# Altium schematic sheet Glog 5G_V1.SchDoc: RCW-360Pro-4G
size A2; DocumentNumber: JC-2.757.366DL; SheetNumber: 1; SheetTotal: 2
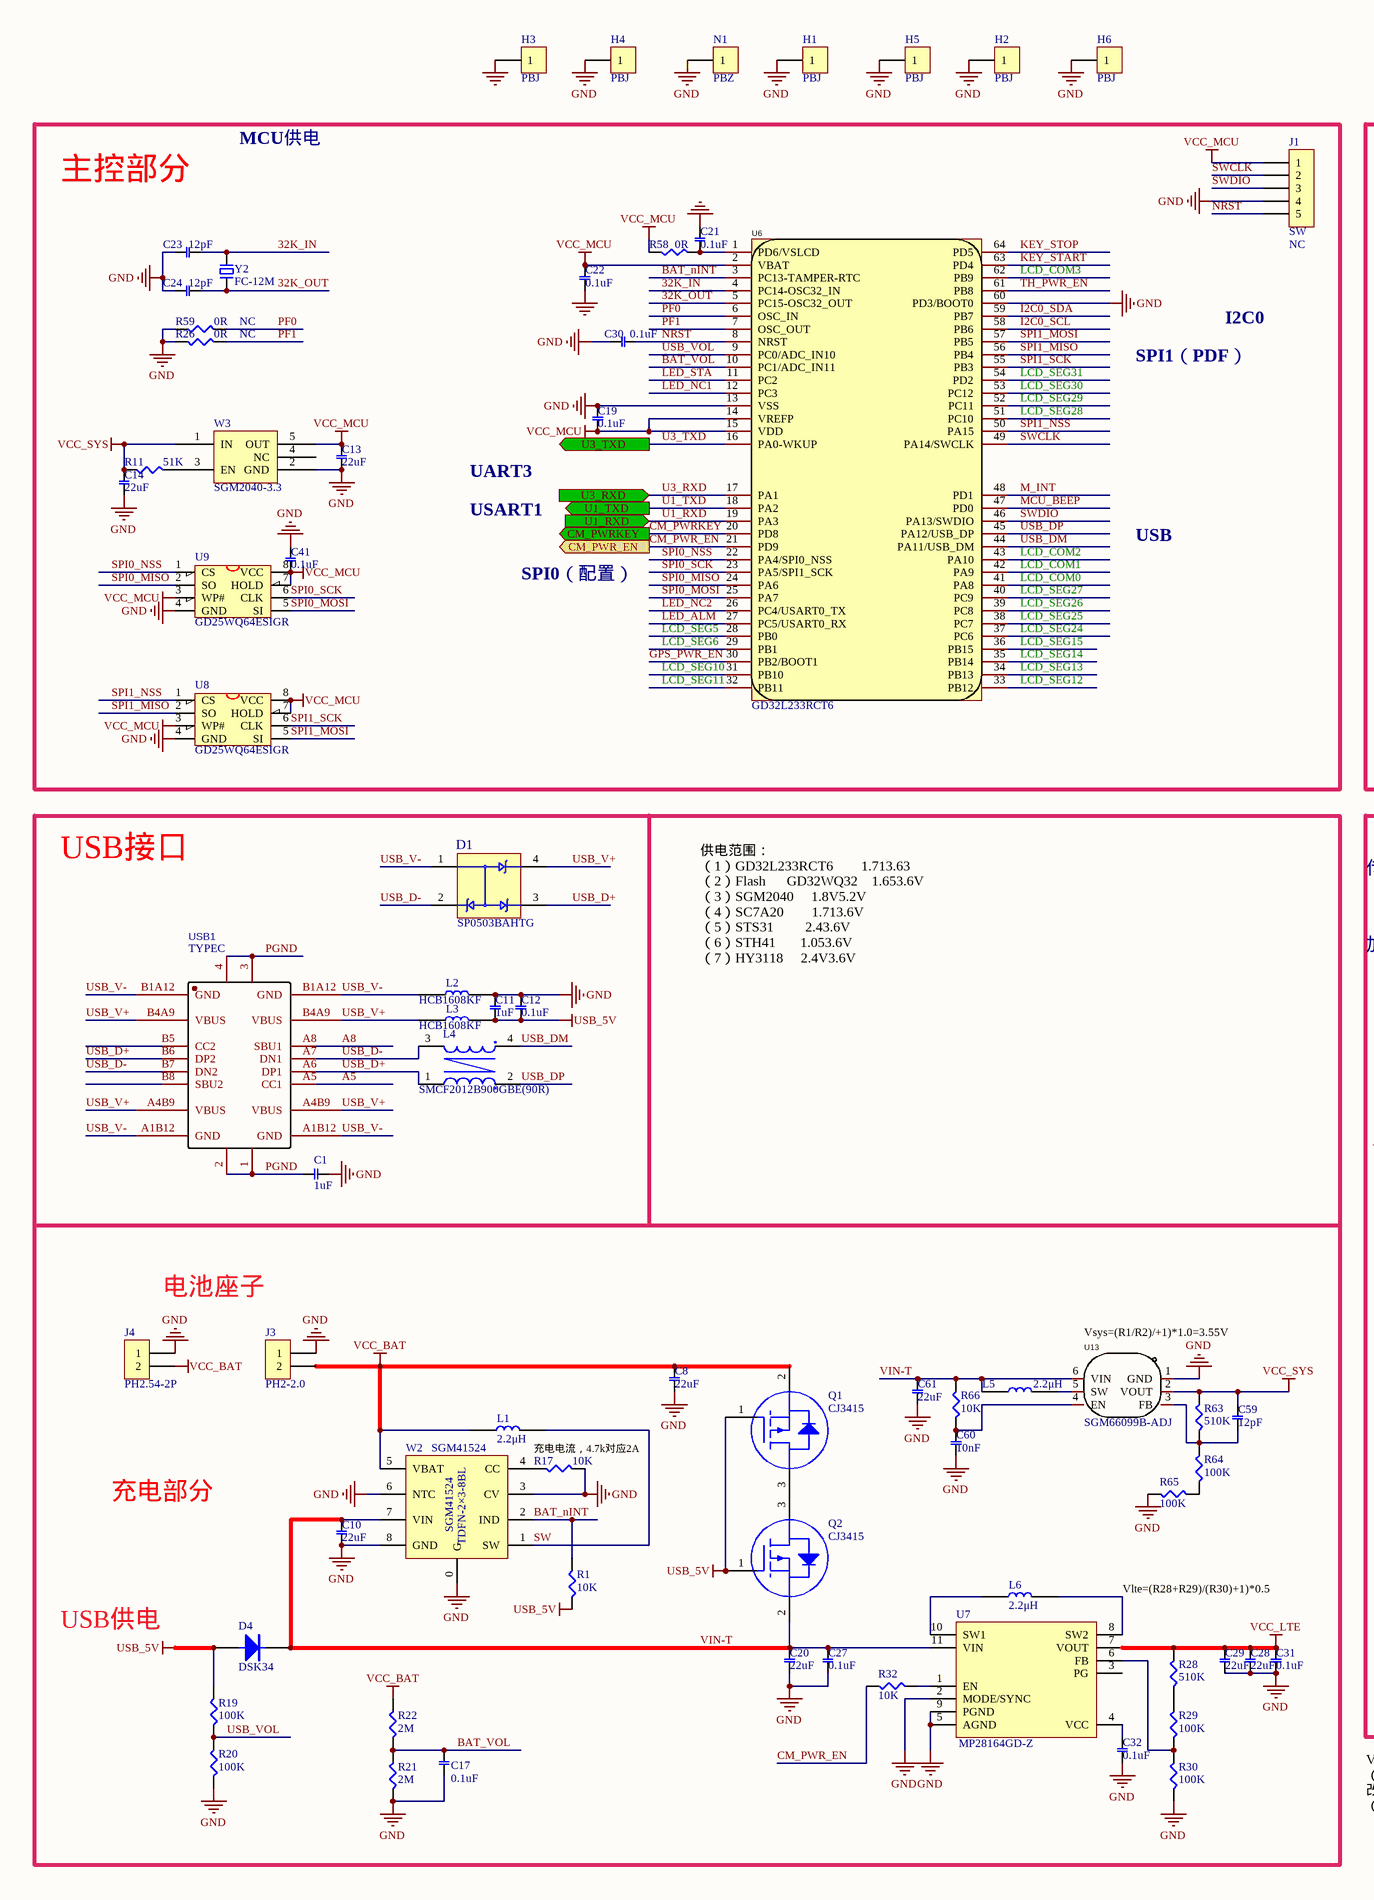
[diagram p0: Glog 5G_V1.SchDoc, left]
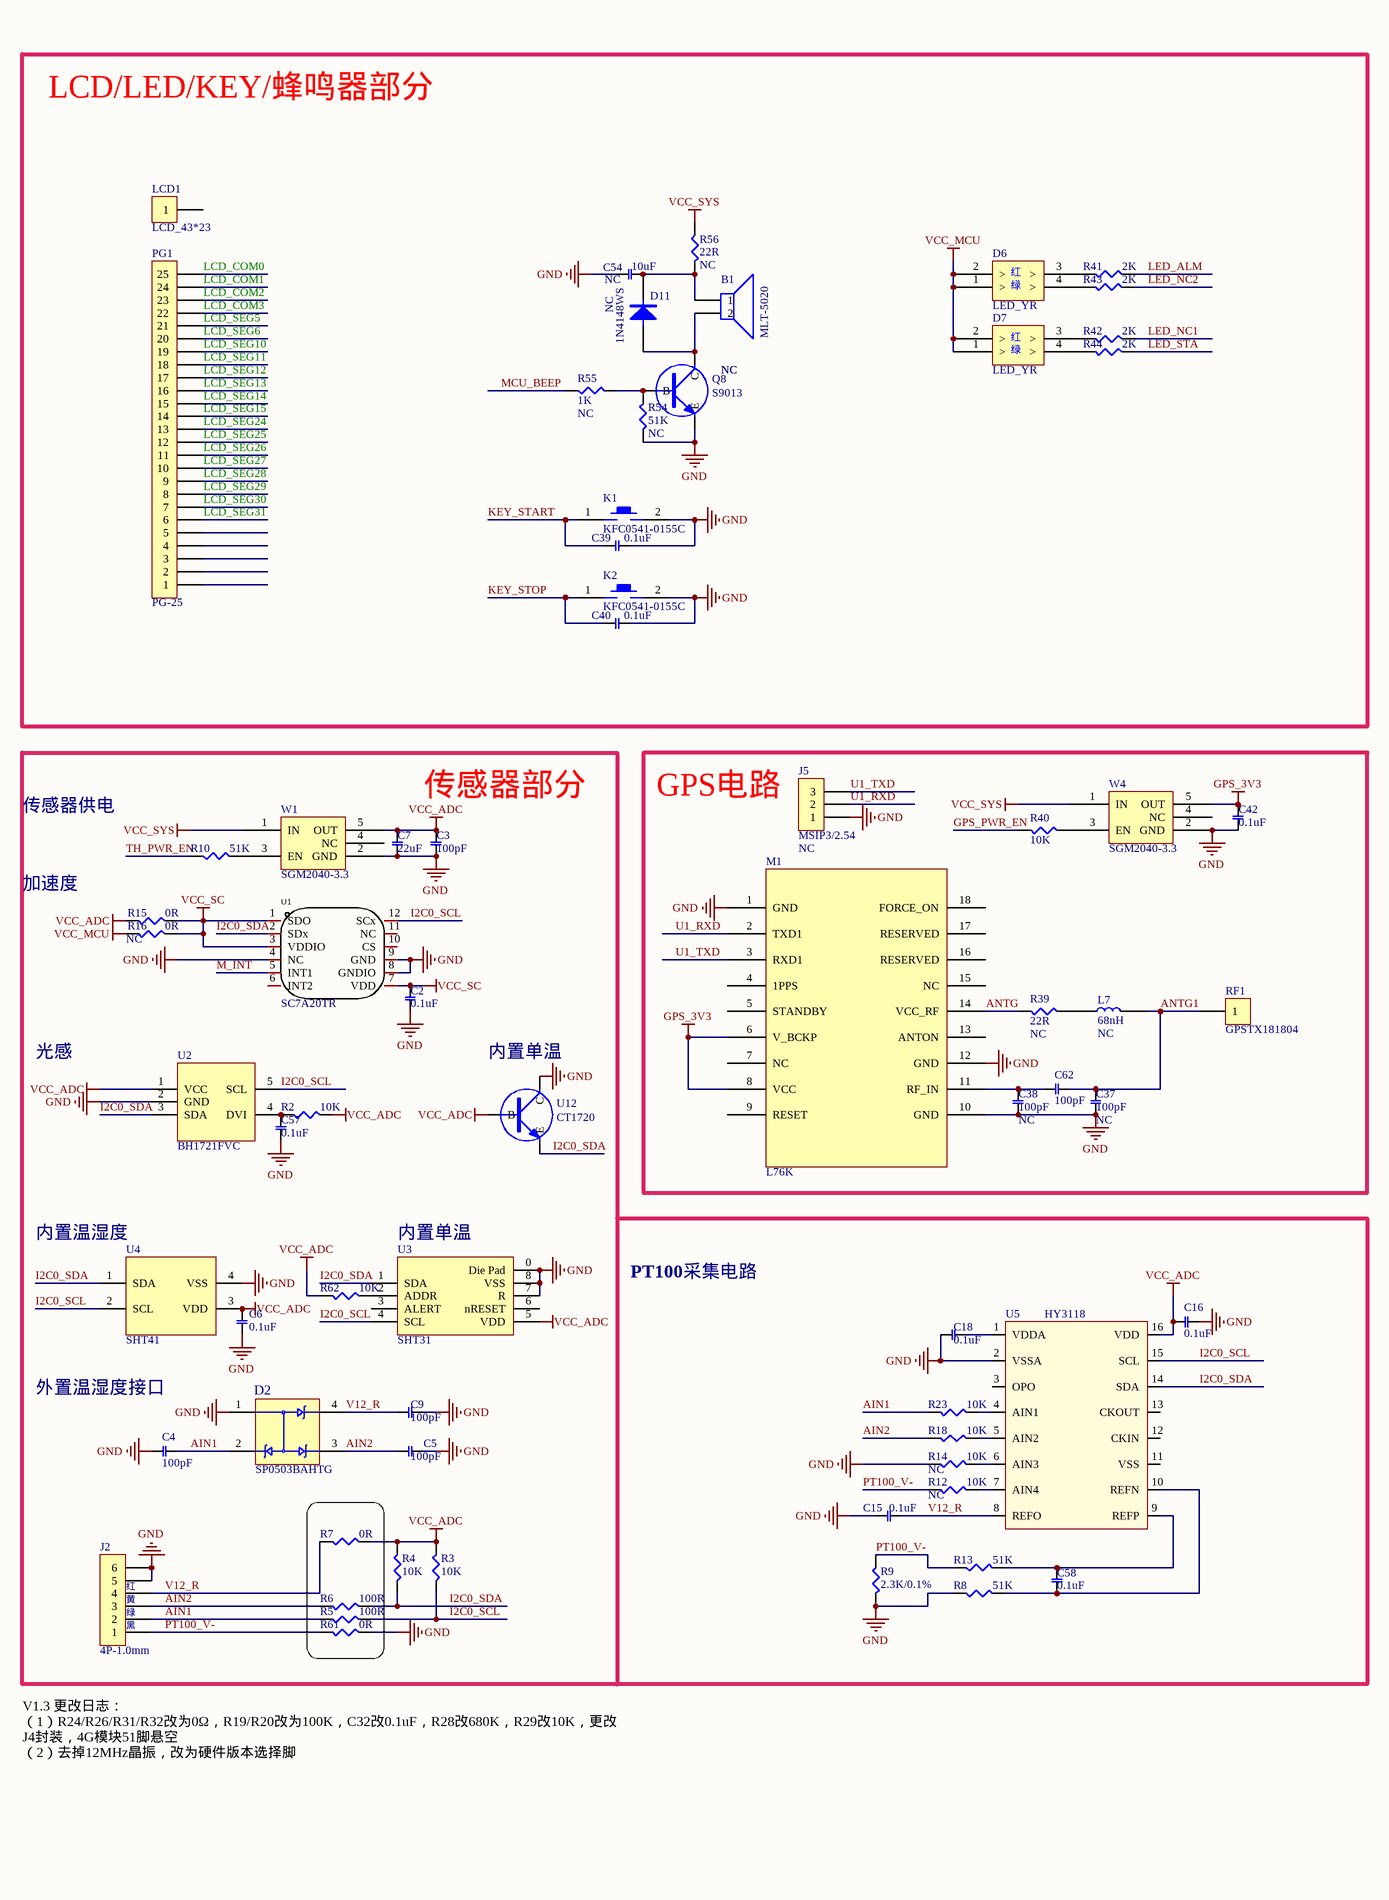
[diagram p1: Glog 5G_V1.SchDoc, right]

## Parts
B1  选焊: NC  [MLT-5225]  (hidden comment: MLT-5020)
C1  1uF  [0402C]
C2  0.1uF  [0402C]
C3  100pF  [0402C]
C4  100pF  [0402C]
C5  100pF  [0402C]
C6  0.1uF  [0402C]
C7  22uF  [0603C]
C8  22uF  [0603C]
C9  100pF  [0402C]
C10  22uF  [0603C]
C11  1uF  [0402C]
C12  0.1uF  [0402C]
C13  22uF  [0603C]
C14  22uF  [0603C]
C15  0.1uF  [0402C]
C16  0.1uF  [0402C]
C17  0.1uF  [0402C]
C18  0.1uF  [0402C]
C19  0.1uF  [0402C]
C20  22uF  [0603C]
C21  0.1uF  [0402C]
C22  0.1uF  [0402C]
C23  12pF  [0402C]
C24  12pF  [0402C]
C27  0.1uF  [0402C]
C28  22uF  [0603C]
C29  22uF  [0603C]
C30  0.1uF  [0402C]
C31  0.1uF  [0402C]
C32  0.1uF  [0402C]
C37  选焊: NC  [0402C]  (hidden comment: 100pF)
C38  选焊: NC  [0402C]  (hidden comment: 100pF)
C39  0.1uF  [0402C]
C40  0.1uF  [0402C]
C41  0.1uF  [0402C]
C42  0.1uF  [0402C]
C54  选焊: NC  [0603C]  (hidden comment: 10uF)
C57  0.1uF  [0402C]
C58  0.1uF  [0402C]
C59  12pF  [0402C]
C60  10nF  [0402C]
C61  22uF  [0603C]
C62  100pF  [0402C]
D1  SP0503BAHTG  [SP0503]
D2  SP0503BAHTG  [SP0503]
D4  DSK34  [SOD-123FL]
D6  LED_YR  [TWO_LED_2COL_0805]
D7  LED_YR  [TWO_LED_2COL_0805]
D11  选焊: NC  [SOD123]  (hidden comment: 1N4148WS)
H1  PBJ  [PBZJZ]
H2  PBJ  [PBZJZ]
H3  PBJ  [PBZJZ]
H4  PBJ  [PBZJZ]
H5  PBJ  [PBZJZ]
H6  PBJ  [PBZJZ]
J1  SW  选焊: NC  [HDR1X5]
J2  4P-1.0mm  [SH1.0MM-4P]
J3  PH2-2.0  [smd2 dh2]
J4  PH2.54-2P  [SMD_DH2.54_L]
J5  选焊: NC  [SIP-3(2.54MM)]  (hidden comment: MSIP3/2.54)
K1  KFC0541-0155C  [KEY-0505]
K2  KFC0541-0155C  [KEY-0505]
L1  2.2μH  [SMD-4020]
L2  HCB1608KF  [0805L]
L3  HCB1608KF  [0805L]
L4  SMCF2012B900GBE(90R)  [SMCF2012]
L5  2.2μH  [SMD-4020]
L6  2.2μH  [SMD-4020]
L7  选焊: NC  [0603L]  (hidden comment: 68nH)
LCD1  LCD_43*23  [LCD_43*23*2.8]
M1  L76K  [L76CGPS]
N1  PBZ  [PBZ_36*28mm]
PG1  PG-25  [PG25-L46*W2*H3mm]
Q1  CJ3415  [SOT-23-MOS]
Q2  CJ3415  [SOT-23-MOS]
Q8  选焊: NC  [SOT23-N]  (hidden comment: S9013)
R1  10K  [0402R]
R2  10K  [0402R]
R3  10K  [0402R]
R4  10K  [0402R]
R5  100R  [0402R]
R6  100R  [0402R]
R7  0R  [0402R]
R8  51K  [0402R]
R9  2.3K/0.1%  [1206R]
R10  51K  [0402R]
R11  51K  [0402R]
R12  选焊: NC  [0402R]  (hidden comment: 10K)
R13  51K  [0402R]
R14  选焊: NC  [0402R]  (hidden comment: 10K)
R15  0R  [0402R]
R16  选焊: NC  [0402R]  (hidden comment: 0R)
R17  10K  [0402R]
R18  10K  [0402R]
R19  100K  [0402R]
R20  100K  [0402R]
R21  2M  [0402R]
R22  2M  [0402R]
R23  10K  [0402R]
R26  选焊: NC  [0402R]  (hidden comment: 0R)
R28  510K  [0603R]
R29  100K  [0402R]
R30  100K  [0402R]
R32  10K  [0402R]
R39  选焊: NC  [0402R]  (hidden comment: 22R)
R40  10K  [0402R]
R41  2K  [0402R]
R42  2K  [0402R]
R43  2K  [0402R]
R44  2K  [0402R]
R54  选焊: NC  [0402R]  (hidden comment: 51K)
R55  选焊: NC  [0402R]  (hidden comment: 1K)
R56  选焊: NC  [0402R]  (hidden comment: 22R)
R58  0R  [0402R]
R59  选焊: NC  [0402R]  (hidden comment: 0R)
R61  0R  [0402R]
R62  10K  [0402R]
R63  510K  [0603R]
R64  100K  [0402R]
R65  100K  [0402R]
R66  10K  [0402R]
RF1  GPSTX181804  [GPSTX_18*18*4mm]
U1  SC7A20TR  [LGA-12_L2.0-W2.0-P0.50-BL]
U2  BH1721FVC  [BH1721FVC]
U3  SHT31  [SHT3X]
U4  SHT41  [SHT4X]
U5  HY3118  [TSSOP16]
U6  GD32L233RCT6  [LQFP-64]
U7  MP28164GD-Z  [QFN11]
U8  GD25WQ64ESIGR  [SOP8]
U9  GD25WQ64ESIGR  [SOP8]
U12  CT1720  [SOT23-N]
U13  SGM66099B-ADJ  [TDFN-6_L2.0-W2.0-P0.65-BL-EP]
USB1  TYPEC  [USB-TypeC]
W1  SGM2040-3.3  [SOT23-5]
W2  SGM41524  [SGM41524]
W3  SGM2040-3.3  [SOT23-5]
W4  SGM2040-3.3  [SOT23-5]
Y2  FC-12M  [XTAL_2012]

## Blocks framed on the sheet
主控部分: C13 C14 C19 C21-C24 C30 C41 J1 R11 R26 R58 R59 U6 U8 U9 W3 Y2
LCD/LED/KEY/蜂鸣器部分: B1 C39 C40 C54 D6 D7 D11 K1 K2 LCD1 PG1 Q8 R41-R44 R54-R56
USB接口: C1 C8 C10-C12 C17 C20 C27-C29 C31 C32 C59-C61 D1 D4 J3 J4 L1-L6 Q1 Q2 R1 R17 R19-R22 R28-R30 R32 R63-R66 U7 U13 USB1 W2
传感器部分: C2-C7 C9 C57 D2 J2 R2-R7 R10 R15 R16 R61 R62 U1-U4 U12 W1
GPS电路: C37 C38 C42 C62 J5 L7 M1 R39 R40 RF1 W4

## Ports
CM_PWR_EN (out), CM_PWRKEY (out), U1_RXD (in), U1_TXD (out), U3_RXD (in), U3_TXD (out)

## Nets
GND: C1.2 C2.2 C3.2 C4.2 C5.1 C6.2 C7.2 C8.1 C9.1 C10.1 C11.1 C12.1 C13.2 C14.2 C15.2 C16.2 C17.2 C18.1 C19.2 C20.2 C21.1 C22.2 C23.1 C24.1 C27.1 C28.2 C29.2 C30.2 C31.1 C32.1 C37.2 C38.2 C39.1 C40.1 C41.2 C42.2 C54.1 C57.2 C60.2 C61.2 D2.1 H1.1 H2.1 H3.1 H4.1 H5.1 H6.1 J1.4 J2.5 J2.6 J3.1 J4.1 J5.1 K1.2 K2.2 L2.2 M1.1(GND) M1.10(GND) M1.12(GND) N1.1 Q8.E R8.1 R9.1 R14.2 R17.1 R20.1 R21.1 R26.1 R30.1 R54.2 R59.1 R61.2 R65.2 U1.4(NC) U1.8(GNDIO) U1.9(GND) U2.2(GND) U3.0(Die_Pad) U3.7(R) U3.8(VSS) U4.4(VSS) U5.2(VSSA) U6.13(VSS) U6.60(PD3/BOOT0) U7.2(MODE/SYNC) U7.5(AGND) U7.9(PGND) U8.4(GND) U9.4(GND) U12.C U13.1(GND) W1.2(GND) W2.0(G) W2.3(CV) W2.6(NTC) W2.8(GND) W3.2(GND) W4.2(GND)
GPS_3V3: C42.1 M1.6(V_BCKP) M1.8(VCC) W4.5(OUT)
USB_5V: C11.2 C12.2 D4.A L3.2 Q1.1 Q2.1 R1.1 R19.2
VCC_ADC: C3.1 C6.1 C7.1 C16.1 R2.1 R3.2 R4.2 R7.2 R15.1 R62.2 U2.1(VCC) U3.5(VDD) U4.3(VDD) U5.16(VDD) U12.B W1.5(OUT)
VCC_BAT: C8.2 J3.2 J4.2 L1.1 Q1.2 R22.2 W2.5(VBAT)
VCC_LTE: C28.1 C29.1 C31.2 R28.2 U7.7(VOUT)
VCC_MCU: C13.1 C19.1 C22.1 C41.1 D6.1(>) D6.2(>) D7.1(>) D7.2(>) J1.1 R16.1 R58.1 U6.2(VBAT) U6.14(VREFP) U6.15(VDD) U8.3(WP#) U8.7(HOLD) U8.8(VCC) U9.3(WP#) U9.7(HOLD) U9.8(VCC) W3.5(OUT)
VCC_SC: C2.1 R15.2 R16.2 U1.1(SDO) U1.3(VDDIO) U1.7(VDD)
VCC_SYS: C14.1 C59.2 R11.1 R56.2 R63.2 U13.2(VOUT) W1.1(IN) W3.1(IN) W4.1(IN)
32K_IN: C23.2 U6.4(PC14-OSC32_IN) Y2.2
32K_OUT: C24.2 U6.5(PC15-OSC32_OUT) Y2.1
A5: USB1.A5(CC1)
A8: USB1.A8(SBU1)
AIN1: C4.1 D2.2 J2.2 R5.2 R23.2
AIN2: C5.2 D2.3 J2.3 R6.2 R18.2
ANTG: M1.14(VCC_RF) R39.1
ANTG1: C37.1 C62.2 L7.2 RF1.1
BAT_nINT: R1.2 U6.3(PC13-TAMPER-RTC) W2.2(IND)
BAT_VOL: C17.1 R21.2 R22.1 U6.10(PC1/ADC_IN11)
CM_PWR_EN: R32.2 U6.21(PD9) ; port CM_PWR_EN
CM_PWRKEY: U6.20(PD8) ; port CM_PWRKEY
GPS_PWR_EN: R40.2 U6.30(PB2/BOOT1)
I2C0_SCL: R3.1 R5.1 U1.12(SCx) U2.5(SCL) U3.4(SCL) U4.2(SCL) U5.15(SCL) U6.58(PB6)
I2C0_SDA: R4.1 R6.1 U1.2(SDx) U2.3(SDA) U3.1(SDA) U4.1(SDA) U5.14(SDA) U6.59(PB7) U12.E
KEY_START: C39.2 K1.1 U6.63(PD4)
KEY_STOP: C40.2 K2.1 U6.64(PD5)
LCD_COM0: PG1.25 U6.41(PA8)
LCD_COM1: PG1.24 U6.42(PA9)
LCD_COM2: PG1.23 U6.43(PA10)
LCD_COM3: PG1.22 U6.62(PB9)
LCD_SEG5: PG1.21 U6.28(PB0)
LCD_SEG6: PG1.20 U6.29(PB1)
LCD_SEG10: PG1.19 U6.31(PB10)
LCD_SEG11: PG1.18 U6.32(PB11)
LCD_SEG12: PG1.17 U6.33(PB12)
LCD_SEG13: PG1.16 U6.34(PB13)
LCD_SEG14: PG1.15 U6.35(PB14)
LCD_SEG15: PG1.14 U6.36(PB15)
LCD_SEG24: PG1.13 U6.37(PC6)
LCD_SEG25: PG1.12 U6.38(PC7)
LCD_SEG26: PG1.11 U6.39(PC8)
LCD_SEG27: PG1.10 U6.40(PC9)
LCD_SEG28: PG1.9 U6.51(PC10)
LCD_SEG29: PG1.8 U6.52(PC11)
LCD_SEG30: PG1.7 U6.53(PC12)
LCD_SEG31: PG1.6 U6.54(PD2)
LED_ALM: R41.2 U6.27(PC5/USART0_RX)
LED_NC1: R42.2 U6.12(PC3)
LED_NC2: R43.2 U6.26(PC4/USART0_TX)
LED_STA: R44.2 U6.11(PC2)
M_INT: U1.5(INT1) U6.48(PD1)
MCU_BEEP: R55.2 U6.47(PD0)
NRST: C30.1 J1.5 U6.8(NRST)
PF0: R59.2 U6.6(OSC_IN)
PF1: R26.2 U6.7(OSC_OUT)
PGND: C1.1 USB1.1 USB1.2 USB1.3 USB1.4
PT100_V-: J2.1 R9.2 R12.2 R13.1 R61.1
SPI0_MISO: U6.24(PA6) U9.2(SO)
SPI0_MOSI: U6.25(PA7) U9.5(SI)
SPI0_NSS: U6.22(PA4/SPI0_NSS) U9.1(CS)
SPI0_SCK: U6.23(PA5/SPI1_SCK) U9.6(CLK)
SPI1_MISO: U6.56(PB4) U8.2(SO)
SPI1_MOSI: U6.57(PB5) U8.5(SI)
SPI1_NSS: U6.50(PA15) U8.1(CS)
SPI1_SCK: U6.55(PB3) U8.6(CLK)
SW: L1.2 W2.1(SW)
SWCLK: J1.2 U6.49(PA14/SWCLK)
SWDIO: J1.3 U6.46(PA13/SWDIO)
TH_PWR_EN: R10.1 U6.61(PB8)
U1_RXD: J5.2 M1.2(TXD1) U6.19(PA3) ; port U1_RXD
U1_TXD: J5.3 M1.3(RXD1) U6.18(PA2) ; port U1_TXD
U3_RXD: U6.17(PA1) ; port U3_RXD
U3_TXD: U6.16(PA0-WKUP) ; port U3_TXD
USB_D+: D1.3 L4.1 USB1.A6(DP1) USB1.B6(DP2)
USB_D-: D1.2 L4.3 USB1.A7(DN1) USB1.B7(DN2)
USB_DM: L4.4 U6.44(PA11/USB_DM)
USB_DP: L4.2 U6.45(PA12/USB_DP)
USB_V+: D1.4 L3.1 USB1.A4B9(VBUS) USB1.B4A9(VBUS)
USB_V-: D1.1 L2.1 USB1.A1B12(GND) USB1.B1A12(GND)
USB_VOL: R19.1 R20.2 U6.9(PC0/ADC_IN10)
V12_R: C9.2 C15.1 D2.4 J2.4 R7.1 U5.8(REFO)
VIN-T: C10.2 C20.1 C27.2 C61.1 D4.K L5.1 Q2.2 R66.2 U7.11(VIN) U13.6(VIN) W2.7(VIN)
NetB1_1: B1.1 C54.2 D11.K R56.1
NetB1_2: B1.2 D11.A Q8.C
NetC18_2: C18.2 U5.1(VDDA)
NetC21_2: C21.2 R58.2 U6.1(PD6/VSLCD)
NetC32_2: C32.2 U7.4(VCC)
NetC38_1: C38.1 C62.1 M1.11(RF_IN)
NetC57_1: C57.1 R2.2 U2.4(DVI)
NetC58_1: C58.1 R8.2 U5.10(REFN)
NetC58_2: C58.2 R13.2 U5.9(REFP)
NetC59_1: C59.1 R63.1 R64.2 U13.3(FB)
NetC60_1: C60.1 R66.1 U13.4(EN)
NetD6_3: D6.3(>) R41.1
NetD6_4: D6.4(>) R43.1
NetD7_3: D7.3(>) R42.1
NetD7_4: D7.4(>) R44.1
NetL5_2: L5.2 U13.5(SW)
NetL6_1: L6.1 U7.10(SW1)
NetL6_2: L6.2 U7.8(SW2)
NetL7_1: L7.1 R39.2
NetQ1_3: Q1.3 Q2.3
NetQ8_B: Q8.B R54.1 R55.1
NetR10_2: R10.2 W1.3(EN)
NetR11_2: R11.2 W3.3(EN)
NetR12_1: R12.1 U5.7(AIN4)
NetR14_1: R14.1 U5.6(AIN3)
NetR17_2: R17.2 W2.4(CC)
NetR18_1: R18.1 U5.5(AIN2)
NetR23_1: R23.1 U5.4(AIN1)
NetR28_1: R28.1 R29.2
NetR29_1: R29.1 R30.2 U7.6(FB)
NetR32_1: R32.1 U7.1(EN)
NetR40_1: R40.1 W4.3(EN)
NetR62_1: R62.1 U3.2(ADDR)
NetR64_1: R64.1 R65.1

Not connected (* = marked no-connect by the designer): LCD1 1; M1 4(1PPS) 5(STANDBY) 7(NC) 9(RESET) 13(ANTON) 15(NC) 16(RESERVED) 17(RESERVED) 18(FORCE_ON); PG1 1 2 3 4 5; U1 6(INT2) 10(CS) 11(NC); U3 3(ALERT) 6(nRESET); U5 3(OPO) 11(VSS) 12(CKIN) 13(CKOUT); U7 3(PG); USB1 B5(CC2) B8(SBU2); W1 4(NC); W3 4(NC); W4 4(NC)

## Notes on the sheet
- MCU供电
- I2C0
- SPI1（PDF）
- UART3
- USART1
- SPI0（配置）
- USB
- 传感器供电
- 加速度
- 供电范围：
  （1）GD32L233RCT6        1.713.63
  （2）Flash      GD32WQ32    1.653.6V
  （3）SGM2040     1.8V5.2V
  （4）SC7A20        1.713.6V
  （5）STS31         2.43.6V
  （6）STH41       1.053.6V
  （7）HY3118     2.4V3.6V
- 光感
- (near U12) 内置单温
- 电池座子
- (near U13) Vsys=(R1/R2)/+1)*1.0=3.55V
- 内置温湿度
- (near U3) 内置单温
- PT100采集电路
- 充电电流，4.7k对应2A
- 外置温湿度接口
- 充电部分
- Vlte=(R28+R29)/(R30)+1)*0.5
- USB供电
- (near J2) 红
- (near J2) 黄
- (near J2) 绿
- (near J2) 黑
- V1.3 更改日志：
  （1）R24/R26/R31/R32改为0Ω，R19/R20改为100K，C32改0.1uF，R28改680K，R29改10K，更改J4封装，4G模块51脚悬空
  （2）去掉12MHz晶振，改为硬件版本选择脚
- 更改标记
- 数量
- 更改
- 签名
- 日期
- 审核
- 设计
- 电路原理图
- 等级
- 标志
- 重量
- 比例
- 标准化
- 工艺
- 批准
- 江苏省精创电气股份有限公司
- 第        张
- 共       张
- (in symbol SGM41524C,TDFN-2×3-8BL) TDFN-2×3-8BL
- (in symbol 发光管0805双色红绿共阴) 红; 绿

## Library data of the parts
B1 = MLT-5020 5X5X2mm: 物料编码(*): 30114010007; 物料名称: 贴片蜂鸣器; 参考价格: 1.4; 用量分母: 1; 贴片/插件: SMD; Values: MLT-5020; 规格型号: MLT-5020 5X5X2mm
C1 C11 = CC-0402-16V-105±10%: 物料编码(*): 30102010001; 物料名称: 贴片瓷片电容; 用量分母: 1; 贴片/插件: SMD; Values: 1uF; 规格型号: CC-0402-16V-105±10%
C2 C12 C17 C19 C21 C22 C27 C30-C32 C39-C42 C57 = CC-0402-50V-104±20%: 物料编码(*): 30102010006; 物料名称: 贴片瓷片电容; 用量分母: 1; 贴片/插件: SMD; Values: 0.1uF; 规格型号: CC-0402-50V-104±20%
C3-C5 C9 = CC-0402-50V-101±5﹪: 物料编码(*): 30102010008; 物料名称: 贴片瓷片电容; 用量分母: 1; 贴片/插件: SMD; Values: 100pF; 规格型号: CC-0402-50V-101±5﹪
C6 C15 C16 C18 C58 = CC-0402-50V-104±20%: 物料编码(*): 30102010006; 物料名称: 贴片瓷片电容; 参考价格: 0.038; 用量分母: 1; 贴片/插件: SMD; Values: 0.1uF; 规格型号: CC-0402-50V-104±20%
C7 C8 C10 C13 C14 C20 C28 C29 C61 = CC-0603-X5R-10V-226±20%: 物料编码(*): 30102020025; 物料名称: 贴片瓷片电容; 用量分母: 1; 贴片/插件: SMD; Values: 22uF; 规格型号: CC-0603-X5R-10V-226±20%
C23 C24 C59 = CC-0402-50V-NPO-12pF±5%: 物料编码(*): 30102010007; 物料名称: 贴片瓷片电容; 用量分母: 1; 贴片/插件: SMD; Values: 12pF; 规格型号: CC-0402-50V-NPO-12pF±5%
C37 C38 C62 = CC-0402-50V-COG-100pF±5%pF: 物料编码(*): 30102010004; 物料名称: 贴片瓷片电容; 参考价格: 0.038; 用量分母: 1; 贴片/插件: SMD; Values: 100pF; 规格型号: CC-0402-50V-COG-100pF±5%pF
C54 = CC-0603-X7R-10V-106±20%: 物料编码(*): 30102020018; 物料名称: 贴片瓷片电容; 用量分母: 1; 贴片/插件: SMD; Values: 10uF; 规格型号: CC-0603-X7R-10V-106±20%
C60 = CC-0402-50V-103±10%: 物料编码(*): 30102010002; 物料名称: 贴片瓷片电容; 参考价格: 0.038; 用量分母: 1; 贴片/插件: SMD; Values: 10nF; 规格型号: CC-0402-50V-103±10%
D1 D2 = SP0503BAHTG,电压瞬态抑制器: 物料编码(*): 30104010003; 物料名称: 贴片二极管; 参考价格: 0.460; 用量分母: 1; 贴片/插件: SMD; Values: SP0503BAHTG; 规格型号: SP0503BAHTG,电压瞬态抑制器
D4 = DSK34,SOD-123FL,肖特基: 物料编码(*): 301040100xx; 物料名称: 贴片二极管; 用量分母: 1; 贴片/插件: SMD; Values: DSK34; 规格型号: DSK34,SOD-123FL,肖特基
D6 = 发光管0805双色红绿共阴: 规格型号: 四脚红蓝双色正面发光; 物料编码(*): 30107010002; 物料名称: 贴片发光二极管; 参考价格: 0.222; 用量分母: 1; 贴片/插件: SMD; Values: LED_YR
D7 = 发光管0805双色红绿共阴: 物料编码(*): 30107010005; 物料名称: 贴片发光二极管; 参考价格: 0.222; 用量分母: 1; 贴片/插件: SMD; Values: LED_YR; 规格型号: 发光管0805双色红绿共阴
D11 = 1N4148WS,SOD323: 物料编码(*): 30104010035; 物料名称: 贴片二极管; 用量分母: 1; 贴片/插件: SMD; Values: 1N4148WS; 规格型号: 1N4148WS,SOD323
H1-H6 = KD-PBJ001,6.5*0.8*1.28mm,材质SUS304,镀镍 镀锡,屏蔽罩夹子: 物料编码(*): 30508000096; 物料名称: 金属罩; 用量分母: 1; 贴片/插件: SMD; Values: PBJ; 规格型号: KD-PBJ001,6.5*0.8*1.28mm,材质SUS304,镀镍 镀锡,屏蔽罩夹子
J1 = CON5: Connector
J2 = 4P座子,1.0mm,贴片: 物料编码(*): 30117060103; 物料名称: 插头/插座; 用量分母: 1.00; 贴片/插件: SMD; Values: 4P-1.0mm; 规格型号: 4P座子,1.0mm,贴片
J3 = PH-2P-2.0,卧式贴片插座,米白色: 物料编码(*): 30117020006; 物料名称: 条形连接器; 用量分母: 1.00; 贴片/插件: SMD; Values: PH2-2.0; 规格型号: PH-2P-2.0,卧式贴片插座,米白色
J4 = PH2.0-2P胶壳,立贴片90度弯针插座,编带: 规格型号: XH2.54-2P,立式贴片插座; 选焊: noCharge; 物料编码(*): 30117060195; 物料名称: 插头/插座; 用量分母: 1; Values: PH2.54-2P
J5 = 1*3PIN-直脚-2.54mm: 物料名称: 方脚插针; 物料属性: 外购; 物料类型: 普通件; 单位(*): PCS; 发料仓库(*): 原材料仓; 使用状态: 使用; 贴片/插件: DIP; 规格型号: 1*3PIN-直脚-2.54mm; Values: MSIP3/2.54
K1 K2 = KFC-0541-0155C,编带: 物料编码(*): 30115010030; 物料名称: 贴片轻触开关; 参考价格: 0.098; 用量分母: 1; 贴片/插件: SMD; Values: KFC0541-0155C; 规格型号: KFC-0541-0155C,编带
L1 = WPN4020H2R2MT: 选焊: Charge; 物料编码(*): 30103010064; 物料名称: 电感; 参考价格: 0.3; 用量分母: 1; 贴片/插件: SMD; Values: 2.2μH; 规格型号: WPN4020H2R2MT
L2 L3 = HCB1608KF-800T30: 物料编码(*): 30103110008; 物料名称: 贴片磁珠; 用量分母: 1; 贴片/插件: SMD; Values: HCB1608KF; 规格型号: HCB1608KF-800T30
L4 = SMCF2012B900GBE(90R),共模,贴片: 物料编码(*): 30103010047; 物料名称: 电感; 用量分母: 1; 贴片/插件: SMD; Values: SMCF2012B900GBE(90R); 规格型号: SMCF2012B900GBE(90R),共模,贴片
L5 L6 = WPN4020H2R2MT: 物料编码(*): 30103010064; 物料名称: 电感; 参考价格: 0.3; 用量分母: 1; 贴片/插件: SMD; Values: 2.2μH; 规格型号: WPN4020H2R2MT
L7 = 68nH/±5%,0603,贴片: 物料编码(*): 30103010046; 物料名称: 电感; 用量分母: 1; 贴片/插件: SMD; Values: 68nH; 规格型号: 68nH/±5%,0603,贴片
LCD1 = LCD_43*23*2.8mm-导电条连接: 物料编码(*): 30107060xxx; 物料名称: 段码屏; 用量分母: 1; 贴片/插件: ZP; Values: LCD_43*23; 规格型号: LCD_43*23*2.8mm-导电条连接
M1 = Quectel L76K GPS+北斗+QZSS+GLONASS+Galileo,LCC,超小尺寸,超低功耗,紧凑型多系统联合定位GNSS模块: 物料编码(*): 30105140019; 物料名称: 定位模块; 参考价格: 17.500; 用量分母: 1; 贴片/插件: SMD; Values: L76K; 规格型号: Quectel L76K GPS+北斗+QZSS+GLONASS+Galileo,LCC,超小尺寸,超低功耗,紧凑型多系统联合定位GNSS模块
N1 = 金属屏蔽盖,36*28*2.4mm-0.2mm: 物料编码(*): 305080000xx; 物料名称: 金属罩; 用量分母: 1; 贴片/插件: ZP; Values: PBZ; 规格型号: 金属屏蔽盖,36*28*2.4mm-0.2mm
PG1 = PG-25 导电条 46*2*3 全导电: 物料编码(*): 301179900xx; 物料名称: 连接器; 用量分母: 1; 贴片/插件: ZP; Values: PG-25; 规格型号: PG-25 导电条 46*2*3 全导电
Q1 Q2 = CJ3415: 物料编码(*): 30104030020; 物料名称: 贴片场效应管; 参考价格: 0.150; 用量分母: 1; 贴片/插件: SMD; Values: CJ3415; 规格型号: CJ3415
Q8 = S9013,SOT-23: 物料编码(*): 30104020002; 物料名称: 贴片三极管; 用量分母: 1; 贴片/插件: SMD; Values: S9013; 规格型号: S9013,SOT-23; Footprint: SOT23-P
R1-R4 R12 R14 R17 R18 R23 R40 R62 R66 = RC-0402-1/16W-10K±5%: 物料编码(*): 30101010012; 物料名称: 贴片电阻; 用量分母: 1; 贴片/插件: SMD; 规格型号: RC-0402-1/16W-10K±5%; Values: 10K
R5 R6 = RC-0402-1/10W-100±1%: 物料编码(*): 30101010006; 物料名称: 贴片电阻; 用量分母: 1; 贴片/插件: SMD; Values: 100R; 规格型号: RC-0402-1/10W-100±1%
R7 R26 R32 R58 R59 R61 = RC-0402-1/16W-0±1%: 物料编码(*): 30101010001; 物料名称: 贴片电阻; 参考价格: 0.0015; 用量分母: 1; 贴片/插件: SMD; 规格型号: RC-0402-1/16W-0±1%
  R7 R26 R58 R59 R61: Values: 0R
  R32: Values: 10K
R8 R13 = RC-0402-1/16W-51K±1%,风华高科,RoHS: 物料编码(*): 30101010014; 物料名称: 贴片电阻; 参考价格: 0.0015; 用量分母: 1; 贴片/插件: SMD; Values: 51K; 规格型号: RC-0402-1/16W-51K±1%,风华高科,RoHS
R9 = RC-0204-1/4W-200±0.1%,金属膜电阻: 规格型号: RC-0204-1/4W-2.3K±0.1%,金属膜电阻; 物料编码(*): 30101050018; 物料名称: 贴片电阻; 用量分母: 1; 贴片/插件: SMD; Values: 2.3K/0.1%
R10 R11 R54 = RC-0402-1/16W-51K±1%: 物料编码(*): 30101010014; 物料名称: 贴片电阻; 参考价格: 0.0015; 用量分母: 1; 贴片/插件: SMD; Values: 51K; 规格型号: RC-0402-1/16W-51K±1%
R15 R16 = RC-0402-1/16W-0±1%: 物料编码(*): 30101010001; 物料名称: 贴片电阻; 用量分母: 1; 贴片/插件: SMD; 规格型号: RC-0402-1/16W-0±1%; Values: 0R
R19 R20 R29 R30 R64 R65 = RC-0402-1/16W-100K±1%: 物料编码(*): 30101010008; 物料名称: 贴片电阻; 参考价格: 0.0015; 用量分母: 1; 贴片/插件: SMD; Values: 100K; 规格型号: RC-0402-1/16W-100K±1%
R21 R22 = RC-0402-1/16W-2M±1%: 物料编码(*): 30101010002; 物料名称: 贴片电阻; 参考价格: 0.0015; 用量分母: 1; 贴片/插件: SMD; Values: 2M; 规格型号: RC-0402-1/16W-2M±1%
R28 R63 = RC-0603-1/16W-510K±1%: 物料编码(*): 30101020027; 物料名称: 贴片电阻; 参考价格: 0.0032; 用量分母: 1; 贴片/插件: SMD; Values: 510K; 规格型号: RC-0603-1/16W-510K±1%
R39 R56 = RC-0402-1/16W-22±1%: 物料编码(*): 30101010009; 物料名称: 贴片电阻; 参考价格: 0.0015; 用量分母: 1; 贴片/插件: SMD; Values: 22R; 规格型号: RC-0402-1/16W-22±1%
R41-R44 = RC-0402-1/16W-2K±5%: 物料编码(*): 30101010011; 物料名称: 贴片电阻; 参考价格: 0.0015; 用量分母: 1; 贴片/插件: SMD; Values: 2K; 规格型号: RC-0402-1/16W-2K±5%
R55 = RC-0402-1/16W-1K±5%: 物料编码(*): 30101010010; 物料名称: 贴片电阻; 用量分母: 1; 贴片/插件: SMD; 规格型号: RC-0402-1/16W-1K±5%; Values: 1K
RF1 = GPS陶瓷有源天线 18X18X4MM PCB焊接: 物料编码(*): 301230200xx; 物料名称: GPS天线; 用量分母: 1; 贴片/插件: DIP; Values: GPSTX181804; 规格型号: GPS陶瓷有源天线 18X18X4MM PCB焊接
U1 = SC7A20TR: 物料编码(*): 30122990009; 物料名称: 其他传感器组件(OS); 用量分母: 1; 贴片/插件: SMD; Values: SC7A20TR; 规格型号: SC7A20TR
U2 = 光照传感器,BH1721FVC,WSOF5,ROHM,RoHS: 物料编码(*): 30122990008; 物料名称: 其他传感器组件(OS); 用量分母: 1; 贴片/插件: SMD; Values: BH1721FVC; 规格型号: 光照传感器,BH1721FVC,WSOF5,ROHM,RoHS
U3 = SHT31,贴片: 物料编码(*): 30122010237; 物料名称: 温(湿)度传感器; 用量分母: 1; 贴片/插件: SMD; Values: SHT31; 规格型号: SHT31,贴片
U4 = SHT41-DFN4: 物料编码(*): 30122010565; 物料名称: 温(湿)度传感器; Values: SHT41; 规格型号: SHT41-DFN4
U5 = HY3118,SSOP-16,AD转换器: 物料编码(*): 30105140004; 物料名称: AD/DA转换; 用量分母: 1; 贴片/插件: SMD; Values: HY3118; 规格型号: HY3118,SSOP-16,AD转换器
U6 = GD32L233RCT6,LQFP64: 物料编码(*): 30105010200; 物料名称: 贴片MCU; 参考价格: 5.000; 用量分母: 1; 贴片/插件: SMD; Values: GD32L233RCT6; 规格型号: GD32L233RCT6,LQFP64
U7 = MP28164GD-Z: 物料编码(*): 30105040016; 物料名称: 电源管理芯片; 用量分母: 1; 贴片/插件: SMD; Values: MP28164GD-Z; 规格型号: MP28164GD-Z
U8 U9 = GD25WQ64ESIGR SOP8 208mil: xx25X16_32; 物料编码(*): 30105100041; 物料名称: 存储器; 用量分母: 1; 贴片/插件: SMD; Values: GD25WQ64ESIGR; 规格型号: GD25WQ64ESIGR SOP8 208mil
U12 = S9013,SOT-23: 规格型号: CT1720KR-A,SOT23-3,SENSYLINK,ROHS; 物料编码(*): 30122010459; 物料名称: 温(湿)度传感器; 用量分母: 1; 贴片/插件: SMD; Values: CT1720; Footprint: SOT23-P
U13 = SGM66099B-ADJYTDI6G/TR: 物料编码(*): 30105030XXX; 物料名称: 开关稳压器; 用量分母: 1; 贴片/插件: SMD; Values: SGM66099B-ADJ; 规格型号: SGM66099B-ADJYTDI6G/TR
USB1 = USB,TYPE-C 连接器,母座单排,16P,SMT四脚插板: 物料编码(*): 30117060099; 物料名称: 插头/插座; 参考价格: 0.55; 用量分母: 1; 贴片/插件: SMD; Values: TYPEC; 规格型号: USB,TYPE-C 连接器,母座单排,16P,SMT四脚插板
W1 W3 W4 = SGM2040-3.3YN5G/TR,SOT-23-5,贴片: 物料编码(*): 30105020039; 物料名称: 线性稳压器; 用量分母: 1; 贴片/插件: SMD; Values: SGM2040-3.3; 规格型号: SGM2040-3.3YN5G/TR,SOT-23-5,贴片
W2 = SGM41524C,TDFN-2×3-8BL: 选焊: Charge; 物料编码(*): 30105040071; 物料名称: 电源管理芯片; 参考价格: 1.2; 用量分母: 1; 贴片/插件: SMD; Values: SGM41524; 规格型号: SGM41524C,TDFN-2×3-8BL
Y2 = FC-135,32.768KHz,12.5±20PPM: 规格型号: FC-12M,32.768KHz,7pF,20PPM; 物料编码(*): 30108010015; 物料名称: 贴片晶振; 参考价格: 0.800; 用量分母: 1; 贴片/插件: SMD; Values: FC-12M